# Altium schematic sheet AM32_ESC.SchDoc
size A4; SheetNumber: 1; SheetTotal: 2
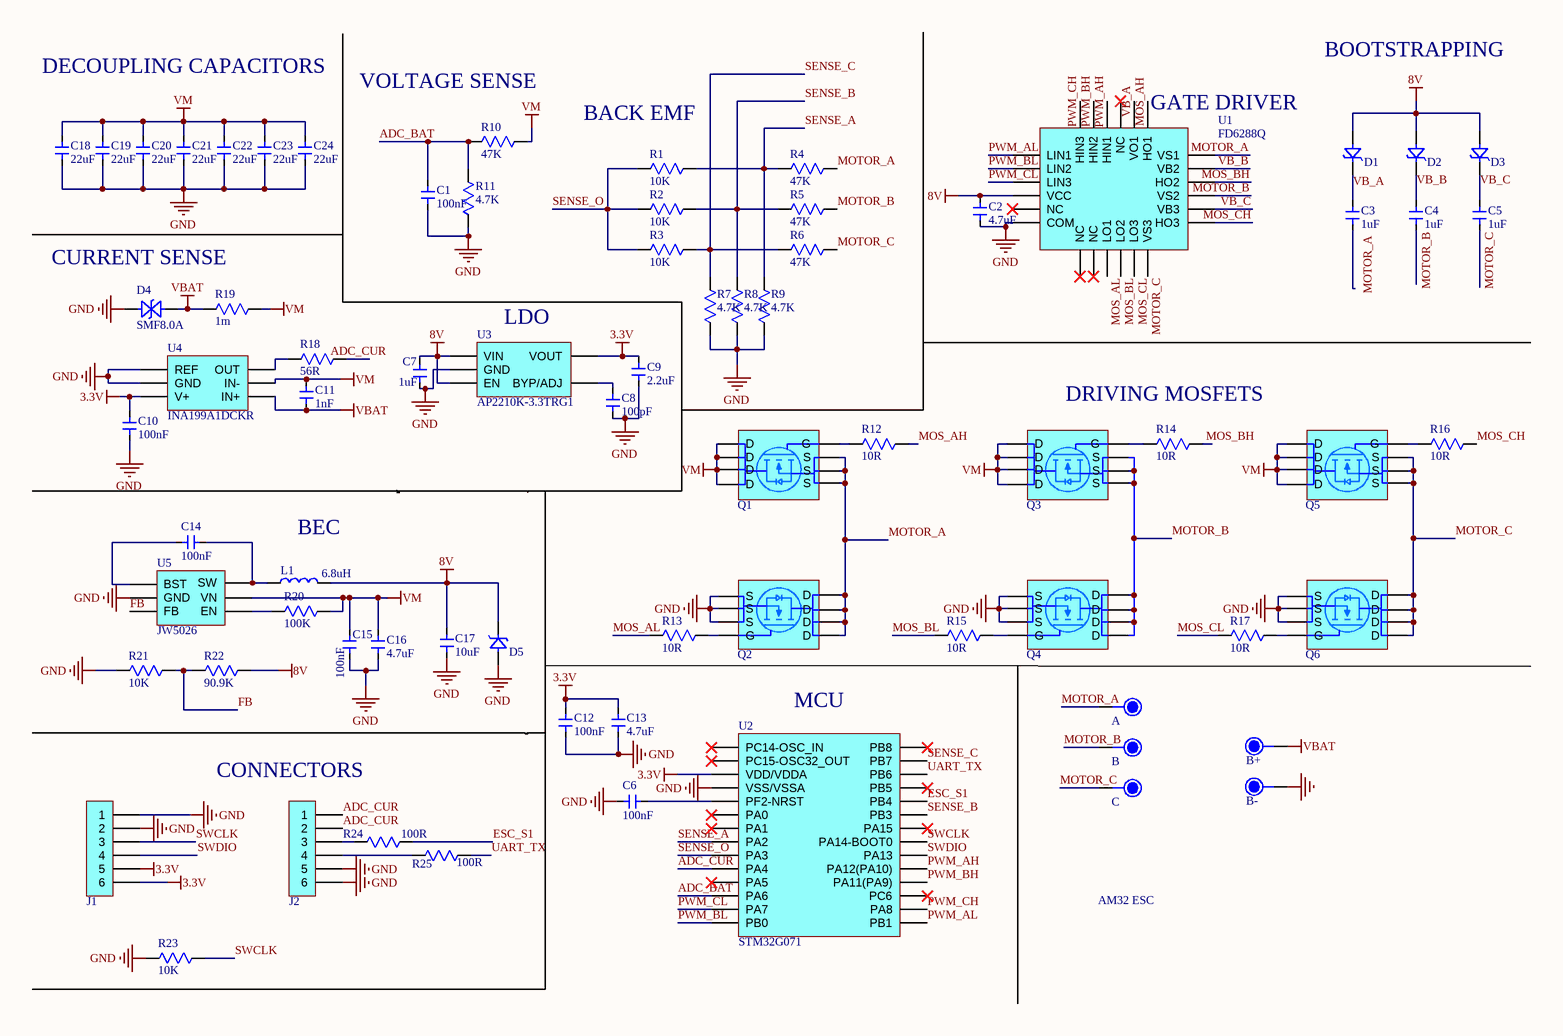
[diagram p0: AM32_ESC.SchDoc]

## Parts
A  PAD  [PAD]  (value not drawn)
B  PAD  [PAD]  (value not drawn)
B+  PAD  [PAD]  (value not drawn)
B-  PAD  [PAD]  (value not drawn)
C  PAD  [PAD]  (value not drawn)
C1  100nF  [C0805]
C2  4.7uF  [C0603]
C3  1uF  [C0603]
C4  1uF  [C0603]
C5  1uF  [C0603]
C6  100nF  [C0805]
C7  1uF  [C0603]
C8  100pF  [C0603]
C9  2.2uF  [C0603]
C10  100nF  [C0805]
C11  1nF  [C0603]
C12  100nF  [C0805]
C13  4.7uF  [C0603]
C14  100nF  [C0805]
C15  100nF  [C0805]
C16  4.7uF  [C0603]
C17  10uF  [C0603]
C18  22uF  [C0805]
C19  22uF  [C0805]
C20  22uF  [C0805]
C21  22uF  [C0805]
C22  22uF  [C0805]
C23  22uF  [C0805]
C24  22uF  [C0805]
D1  Diode  [SOD2512X116N]  (value not drawn)
D2  Diode  [SOD2512X116N]  (value not drawn)
D3  Diode  [SOD2512X116N]  (value not drawn)
D4  SMF8.0A  [SMF8.0]
D5  Diode  [SOD2512X116N]  (value not drawn)
J1  JST_XH  [6 pin header]  (value not drawn)
J2  JST_XH  [6 pin header]  (value not drawn)
L1  6.8uH  [L0806]
Q1  CSD19531  [MOSFET_CSD19531Q5A]  (value not drawn)
Q2  CSD19531  [MOSFET_CSD19531Q5A]  (value not drawn)
Q3  CSD19531  [MOSFET_CSD19531Q5A]  (value not drawn)
Q4  CSD19531  [MOSFET_CSD19531Q5A]  (value not drawn)
Q5  CSD19531  [MOSFET_CSD19531Q5A]  (value not drawn)
Q6  CSD19531  [MOSFET_CSD19531Q5A]  (value not drawn)
R1  10K  [R0603n]
R2  10K  [R0603n]
R3  10K  [R0603n]
R4  47K  [R0603N]
R5  47K  [R0603N]
R6  47K  [R0603N]
R7  4.7K  [R0603N]
R8  4.7K  [R0603N]
R9  4.7K  [R0603N]
R10  47K  [R0603N]
R11  4.7K  [R0603N]
R12  10R  [R0603n]
R13  10R  [R0603n]
R14  10R  [R0603n]
R15  10R  [R0603n]
R16  10R  [R0603n]
R17  10R  [R0603n]
R18  56R  [R0603N]
R19  1m  [RESC5025X120N]
R20  100K  [R0603N]
R21  10K  [R0603n]
R22  90.9K  [R0603N]
R23  10K  [R0603n]
R24  100R  [R0603]
R25  100R  [R0603]
U1  FD6288Q  [FD6288Q]
U2  STM32G071  [STM32G071]
U3  AP2210K-3.3TRG1  [AP2210K-3.3TRG1]
U4  INA199A1DCKR  [INA199A1DCKR]
U5  JW5026  [JW5026]

## Nets
3.3V: C9.1 C10.2 C12.2 C13.2 J1.5 J1.6 U2.3(VDD/VDDA) U3.5(VOUT) U4.3(V+)
8V: C2.2 C7.2 C17.2 D1.1 D2.1 D3.1 D5.2 L1.2 R22.2 U1.4(VCC) U3.1(VIN) U3.3(EN)
GND: B-.1 C1.1 C2.1 C6.1 C7.1 C8.2 C9.2 C10.1 C12.1 C13.1 C15.1 C16.1 C17.1 C18.1 C19.1 C20.1 C21.1 C22.1 C23.1 C24.1 D4.1 D5.1 J1.1 J1.2 J2.5 J2.6 Q2.1(S) Q2.2(S) Q2.3(S) Q4.1(S) Q4.2(S) Q4.3(S) Q6.1(S) Q6.2(S) Q6.3(S) R7.1 R8.1 R9.1 R11.1 R21.1 R23.2 U1.6(COM) U2.4(VSS/VSSA) U3.2(GND) U4.1(REF) U4.2(GND) U5.2(GND)
VBAT: B+.1 C11.1 D4.2 R19.1 U4.4(IN+)
VM: C11.2 C15.2 C16.2 C18.2 C19.2 C20.2 C21.2 C22.2 C23.2 C24.2 Q1.5(D) Q1.6(D) Q1.7(D) Q1.8(D) Q3.5(D) Q3.6(D) Q3.7(D) Q3.8(D) Q5.5(D) Q5.6(D) Q5.7(D) Q5.8(D) R10.2 R19.2 R20.2 U4.5(IN-) U5.5(VN)
ADC_BAT: C1.2 R10.1 R11.2 U2.12(PA6)
ADC_CUR: J2.1 J2.2 R18.2 U2.10(PA4)
ESC_S1: R24.2 U2.24(PB4)
FB: R21.2 R22.1 U5.3(FB)
MOS_AH: R12.2 U1.19(HO1)
MOS_AL: R13.1 U1.9(LO1)
MOS_BH: R14.2 U1.16(HO2)
MOS_BL: R15.1 U1.10(LO2)
MOS_CH: R16.2 U1.13(HO3)
MOS_CL: R17.1 U1.11(LO3)
MOTOR_A: A.1 Q1.1(S) Q1.2(S) Q1.3(S) Q2.5(D) Q2.6(D) Q2.7(D) Q2.8(D) R4.2 U1.18(VS1)
MOTOR_B: B.1 Q3.1(S) Q3.2(S) Q3.3(S) Q4.5(D) Q4.6(D) Q4.7(D) Q4.8(D) R5.2 U1.15(VS2)
MOTOR_C: C.1 Q5.1(S) Q5.2(S) Q5.3(S) Q6.5(D) Q6.6(D) Q6.7(D) Q6.8(D) R6.2 U1.12(VS3)
PWM_AH: U1.22(HIN1) U2.19(PA12(PA10))
PWM_AL: U1.1(LIN1) U2.15(PB1)
PWM_BH: U1.23(HIN2) U2.18(PA11(PA9))
PWM_BL: U1.2(LIN2) U2.14(PB0)
PWM_CH: U1.24(HIN3) U2.16(PA8)
PWM_CL: U1.3(LIN3) U2.13(PA7)
SENSE_A: R1.2 R4.1 R9.2 U2.8(PA2)
SENSE_B: R2.2 R5.1 R8.2 U2.23(PB3)
SENSE_C: R3.2 R6.1 R7.2 U2.27(PB7)
SENSE_O: R1.1 R2.1 R3.1 U2.9(PA3)
SWCLK: J1.3 R23.1 U2.21(PA14-BOOT0)
SWDIO: J1.4 U2.20(PA13)
UART_TX: R25.2 U2.26(PB6)
VB_A: C3.2 D1.2 U1.20(VO1)
VB_B: C4.2 D2.2 U1.17(VB2)
VB_C: C5.2 D3.2 U1.14(VB3)
NetC6_2: C6.2 U2.5(PF2-NRST)
NetC8_1: C8.1 U3.4(BYP/ADJ)
NetC14_1: C14.1 U5.1(BST)
NetC14_2: C14.2 L1.1 U5.6(SW)
NetJ2_3: J2.3 R24.1
NetJ2_4: J2.4 R25.1
NetQ1_4: Q1.4(G) R12.1
NetQ2_4: Q2.4(G) R13.2
NetQ3_4: Q3.4(G) R14.1
NetQ4_4: Q4.4(G) R15.2
NetQ5_4: Q5.4(G) R16.1
NetQ6_4: Q6.4(G) R17.2
NetR18_1: R18.1 U4.6(OUT)
NetR20_1: R20.1 U5.4(EN)

Not connected (* = marked no-connect by the designer): C3 1; C4 1; C5 1; U1 5(NC)* 7(NC)* 8(NC)* 21(NC)*; U2 1(PC14-OSC_IN)* 2(PC15-OSC32_OUT)* 6(PA0)* 7(PA1)* 11(PA5)* 17(PC6)* 22(PA15)* 25(PB5)* 28(PB8)*

## Notes on the sheet
- DECOUPLING CAPACITORS
- VOLTAGE SENSE
- (near U1) GATE DRIVER
- BOOTSTRAPPING
- (near R1) BACK EMF
- CURRENT SENSE
- (near U3) LDO
- DRIVING MOSFETS
- (near L1) BEC
- MCU
- (near J2) CONNECTORS
- AM32 ESC
- Labels drawn without touching a wire or pin: MOTOR_A, MOTOR_B, MOTOR_C
- DWG. NO.
- REV.
- SHT.
- THIS DOCUMENT AND THE DATA DISCLOSED HEREIN OR HEREWITH IS THE PROPERTY OF ALTIUM LIMITED AND MAY BE FREELY DISTRIBUTED IN WHOLE. NO RIGHTS ARE RESERVED OR EXPRESS OR IMPLIED WARANTEE GIVEN.
- REVISION
- DESCRIPTION
- DATE
- APPROVED
- ENG:
- APPROVALS
- PROJECT
- DSN:
- CHK:
- REFERENCE DOCUMENTS
- PROJECT REVISION:
- TITLE
- DOCUMENT REVISION:
- DESIGN ITEM:
- BOM:
- FAB DWG:
- PCB DWG:
- ASSY DWG:
- SCALE:
- SIZE
- B
- CAGE CODE
- FILE NAME
- DWG NO.
- SHEET
- OF
- REV

## Library data of the parts
C1 C6 C10 C12 C14 C15 = C100nF
C2 C13 C16 = C4.7uF
C3-C5 C7 = C1uF
C8 = C100pF
C9 = C2.2uF
C11 = C1nF
C17 = C10uF
C18-C24 = C22uF
L1 = L6.8uH
Q1-Q6 = MOSFET
R1-R3 R21 R23 = R10K
R4-R6 R10 = R47K
R7-R9 R11 = R4.7K
R12-R17 = R10
R18 = R56
R19 = R1m
R20 = R100K
R22 = R90.9k